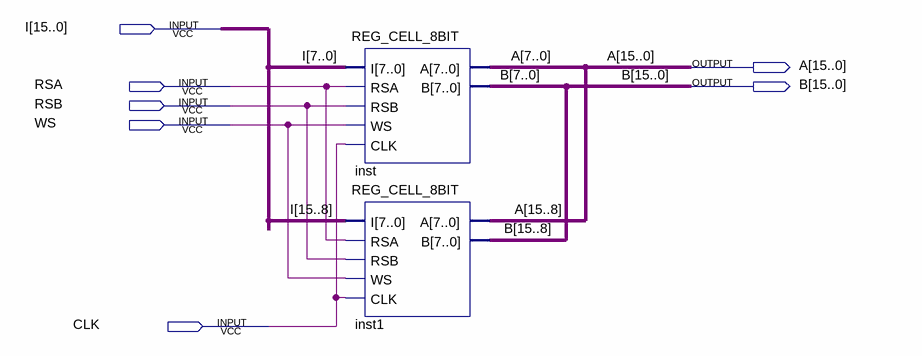
[diagram p0: schematic sheet]
// Quartus schematic REG_CELL_16BIT.bdf as structural Verilog: 2 symbols, 7 pins
module REG_CELL_16BIT (
  input  [15:0] I,
  input  RSA,
  input  RSB,
  input  WS,
  input  CLK,
  output [15:0] A,
  output [15:0] B
);

  REG_CELL_8BIT inst (.I(I[7:0]), .RSA(RSA), .RSB(RSB), .WS(WS), .CLK(CLK), .A(A[7:0]), .B(B[7:0]));
  REG_CELL_8BIT inst1 (.I(I[15:8]), .RSA(RSA), .RSB(RSB), .WS(WS), .CLK(CLK), .A(A[15:8]), .B(B[15:8]));
endmodule
